# Altium project Design_Project.PrjPCB
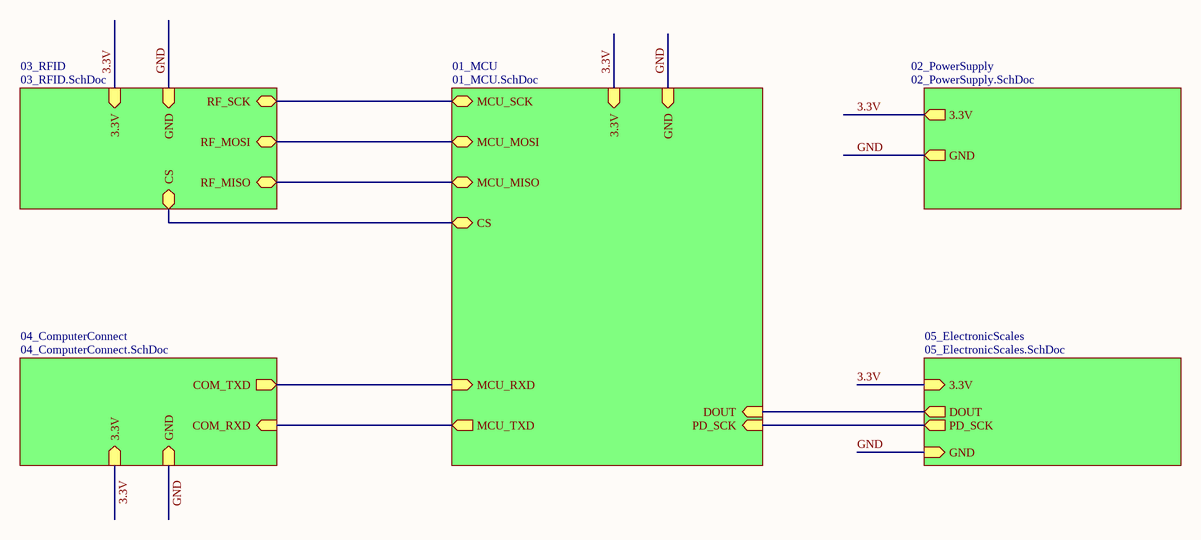
[diagram p0: SheetConnection.SchDoc]
6 sheets, 32 parts. Net scope: hierarchical (ports join the sheet entries above them; power ports are global).
Board files: Design_Project.PcbDoc, Logo.pcbdoc, HX711.PcbDoc
Sheets:
  SheetConnection.SchDoc
    01_MCU = 01_MCU.SchDoc
    05_ElectronicScales = 05_ElectronicScales.SchDoc
    03_RFID = 03_RFID.SchDoc
    04_ComputerConnect = 04_ComputerConnect.SchDoc
    02_PowerSupply = 02_PowerSupply.SchDoc

## Sheet SheetConnection.SchDoc
size A4

### Sub-sheets
01_MCU = 01_MCU.SchDoc: MCU_TXD (out), MCU_RXD (in), MCU_SCK (bidir), MCU_MOSI (bidir), MCU_MISO (bidir), GND (in), 3.3V (in), CS (bidir), DOUT (in), PD_SCK (in)
02_PowerSupply = 02_PowerSupply.SchDoc: 3.3V (out), GND (out)
03_RFID = 03_RFID.SchDoc: RF_SCK (bidir), RF_MOSI (bidir), RF_MISO (bidir), GND (in), 3.3V (in), CS (bidir)
04_ComputerConnect = 04_ComputerConnect.SchDoc: COM_TXD (out), COM_RXD (in), GND (in), 3.3V (in)
05_ElectronicScales = 05_ElectronicScales.SchDoc: 3.3V (in), GND (in), DOUT (out), PD_SCK (out)

### Nets
3.3V: sheet 01_MCU/3.3V, sheet 05_ElectronicScales/3.3V, sheet 03_RFID/3.3V, sheet 04_ComputerConnect/3.3V, sheet 02_PowerSupply/3.3V
GND: sheet 01_MCU/GND, sheet 05_ElectronicScales/GND, sheet 03_RFID/GND, sheet 04_ComputerConnect/GND, sheet 02_PowerSupply/GND
CS: sheet 01_MCU/CS, sheet 03_RFID/CS
DOUT: sheet 01_MCU/DOUT, sheet 05_ElectronicScales/DOUT
MISO: sheet 01_MCU/MCU_MISO, sheet 03_RFID/RF_MISO
MOSI: sheet 01_MCU/MCU_MOSI, sheet 03_RFID/RF_MOSI
PD_SCK: sheet 01_MCU/PD_SCK, sheet 05_ElectronicScales/PD_SCK
SCK: sheet 01_MCU/MCU_SCK, sheet 03_RFID/RF_SCK
NetP1_3: sheet 01_MCU/MCU_RXD, sheet 04_ComputerConnect/COM_TXD
NetP1_4: sheet 01_MCU/MCU_TXD, sheet 04_ComputerConnect/COM_RXD

### Notes on the sheet
- Project:
- MANDevices
- Page Contents:
- Size:
- Date:
- A4
- Checked by:
- Time:
- Revision:
- Sheet
- of
- HaNoi University of
- Science and Technology
- File:

## Sheet 01_MCU.SchDoc
size A4
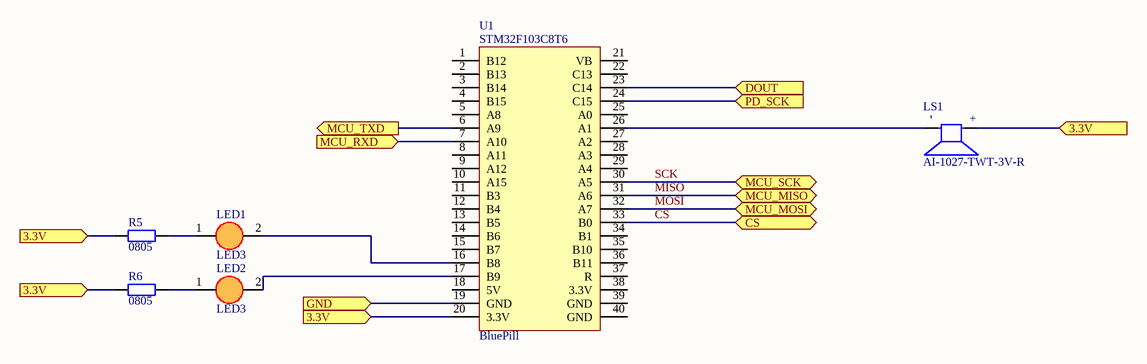
[diagram p1: 01_MCU.SchDoc]

### Parts
LED1  LED3  [LED3mm]
LED2  LED3  [LED3mm]
LS1  AI-1027-TWT-3V-R  [XDCR_AI-1027-TWT-3V-R]
R5  value 0805  [DIEN TRO 0805]  (hidden comment: R0805)
R6  value 0805  [DIEN TRO 0805]  (hidden comment: R0805)
U1  BluePill  [DIP40 - duplicate]

### Ports
3.3V (in), CS (bidir), DOUT (in), GND (in), MCU_MISO (bidir), MCU_MOSI (bidir), MCU_RXD (in), MCU_SCK (bidir), MCU_TXD (out), PD_SCK (in)

### Nets
3.3V: LS1.P R5.1 R6.1 U1.20(3.3V) ; port 3.3V
GND: U1.19(GND) ; port GND
CS: U1.33(B0) ; port CS
DOUT: U1.23(C14) ; port DOUT
MISO: U1.31(A6) ; port MCU_MISO
MOSI: U1.32(A7) ; port MCU_MOSI
PD_SCK: U1.24(C15) ; port PD_SCK
SCK: U1.30(A5) ; port MCU_SCK
NetLED1_1: LED1.1(A) R5.2
NetLED1_2: LED1.2(K) U1.16(B8)
NetLED2_1: LED2.1(A) R6.2
NetLED2_2: LED2.2(K) U1.17(B9)
NetLS1_N: LS1.N U1.26(A1)
NetP1_3: U1.7(A10) ; port MCU_RXD
NetP1_4: U1.6(A9) ; port MCU_TXD

Not connected (* = marked no-connect by the designer): U1 1(B12) 2(B13) 3(B14) 4(B15) 5(A8) 8(A11) 9(A12) 10(A15) 11(B3) 12(B4) 13(B5) 14(B6) 15(B7) 18(5V) 21(VB) 22(C13) 25(A0) 27(A2) 28(A3) 29(A4) 34(B1) 35(B10) 36(B11) 37(R) 38(3.3V) 39(GND) 40(GND)

### Notes on the sheet
- Project:
- MANDevices
- Page Contents:
- Size:
- Date:
- A4
- Checked by:
- Time:
- Revision:
- Sheet
- of
- HaNoi University of
- Science and Technology
- File:
- (in symbol AI-1027-TWT-3V-R) -; +
- (in symbol BluePill) STM32F103C8T6

### Library data of the parts
LED1 LED2 = LED 3mm
LS1 = AI-1027-TWT-3V-R: Buzzers Indicator, Internally Driven Electromechanical/Magnetic 3V 30mA 2.7kHz 80dB @ 3V, 10cm Through Hole PC Pins; MF: PUI Audio, Inc.; Price: None; SnapEDA_Link: https://www.snapeda.com/parts/AI-1027-TWT-3V-R/PUI%20Audio,%20Inc./view-part/7376009/?ref=snap; Purchase-URL: https://pricing.snapeda.com/search/part/AI-1027-TWT-3V-R/?ref=eda; Check_prices: https://www.snapeda.com/parts/AI-1027-TWT-3V-R/PUI%20Audio,%20Inc./view-part/7376009/?ref=eda; Value: *; MP: AI-1027-TWT-3V-R; Package: None; Availability: In Stock
R5 R6 = R0805: Resistor SMD 0805; Published: 8-Jun-2000; LatestRevisionDate: 17-Jul-2002; LatestRevisionNote: Re-released for DXP Platform.; PackageReference: AXIAL-0.4; Publisher: Altium Limited

## Sheet 05_ElectronicScales.SchDoc
size A4
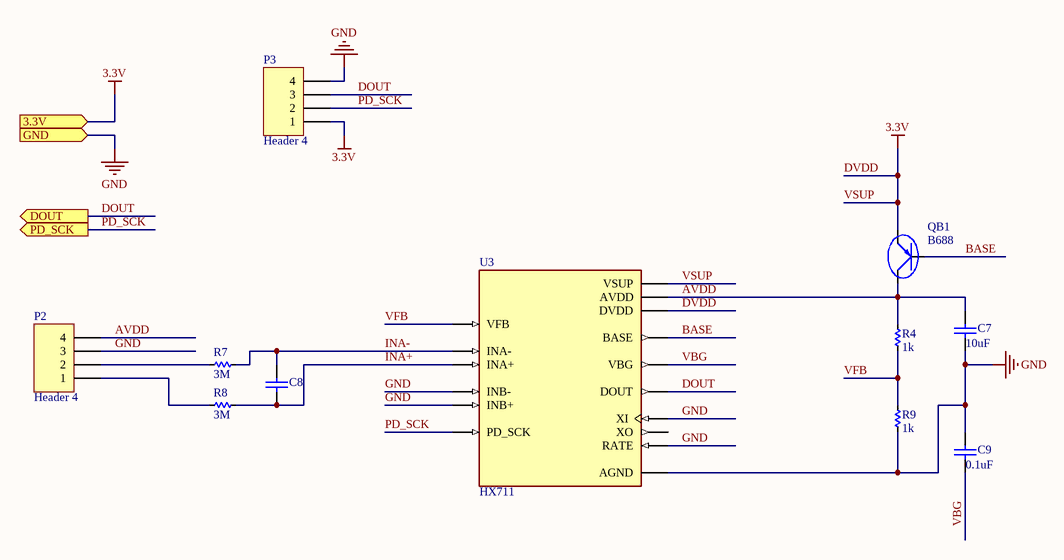
[diagram p2: 05_ElectronicScales.SchDoc]

### Parts
C7  10uF  [C0805]
C8  Capacitor Ceramic  [C0805]  (value not drawn)
C9  0.1uF  [C0805]
P2  Header 4  [HDR1X4]
P3  Header 4  [HDR1X4]
QB1  B688  [QTO-247]
R4  1k  [RES-SMD-0805]
R7  3M  [RES-SMD-0805]
R8  3M  [RES-SMD-0805]
R9  1k  [RES-SMD-0805]
U3  HX711  [SOP127P600X180-16N]

### Ports
3.3V (in), DOUT (out), GND (in), PD_SCK (out)

### Nets
3.3V: P3.1 QB1.3(E) U3.1(VSUP) U3.16(DVDD) ; port 3.3V  [also labelled DVDD, VSUP]
GND: C7.1 C9.2 P2.3 P3.4 R9.2 U3.5(AGND) U3.9(INB-) U3.10(INB+) U3.14(XI) U3.15(RATE) ; port GND
AVDD: C7.2 P2.4 QB1.2(C) R4.1 U3.3(AVDD)
BASE: QB1.1(B) U3.2(BASE)
DOUT: P3.3 U3.12(DOUT) ; port DOUT
INA+: C8.1 R8.2 U3.8(INA+)
INA-: C8.2 R7.2 U3.7(INA-)
PD_SCK: P3.2 U3.11(PD_SCK) ; port PD_SCK
VBG: C9.1 U3.6(VBG)
VFB: R4.2 R9.1 U3.4(VFB)
NetP2_1: P2.1 R8.1
NetP2_2: P2.2 R7.1

Not connected (* = marked no-connect by the designer): U3 13(XO)

### Notes on the sheet
- Project:
- MANDevices
- Page Contents:
- Size:
- Date:
- A4
- Checked by:
- Time:
- Revision:
- Sheet
- of
- HaNoi University of
- Science and Technology
- File:

### Library data of the parts
C7-C9 = CapSMD: Capacitor; Value: 33p; Published: 8-Jun-2000; LatestRevisionDate: 17-Jul-2002; LatestRevisionNote: Re-released for DXP Platform.; PackageReference: RAD-0.3; Publisher: Altium Limited
P2 P3 = Header 4: Header, 4-Pin; LatestRevisionDate: 17-Jul-2002; LatestRevisionNote: Re-released for DXP Platform.; Publisher: Altium Limited
QB1 = B688: Transistor Power Supply; Value: B688
R4 R7-R9 = Res-SMD: Resistor; Manufacturer: Generic Components; Class: Passive; Published: 08/06/2000; Publisher: Altium Hobart Technology Centre
U3 = HX711: Value: *; Availability: Unavailable; Price: None; MP: HX711; Package: None

## Sheet 03_RFID.SchDoc
size A4
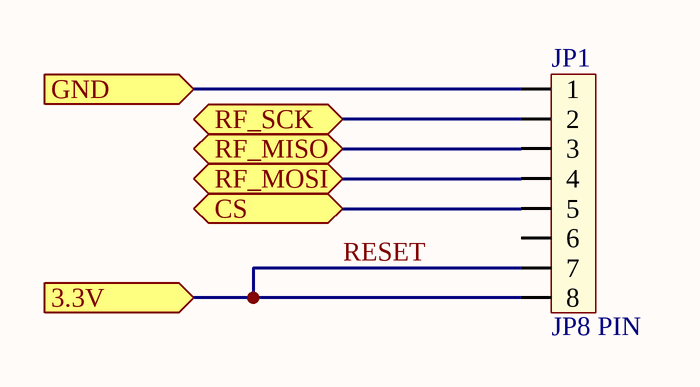
[diagram p3: 03_RFID.SchDoc]

### Parts
JP1  JP8 PIN  [JP8]

### Ports
3.3V (in), CS (bidir), GND (in), RF_MISO (bidir), RF_MOSI (bidir), RF_SCK (bidir)

### Nets
GND: JP1.1 ; port GND
RESET: JP1.7 JP1.8 ; port 3.3V  [project net 3.3V]
CS: JP1.5 ; port CS
MISO: JP1.3 ; port RF_MISO
MOSI: JP1.4 ; port RF_MOSI
SCK: JP1.2 ; port RF_SCK

Not connected (* = marked no-connect by the designer): JP1 6

### Notes on the sheet
- Project:
- MANDevices
- Page Contents:
- Size:
- Date:
- A4
- Checked by:
- Time:
- Revision:
- Sheet
- of
- HaNoi University of
- Science and Technology
- File:

### Library data of the parts
JP1 = JP8: Value: JP7

## Sheet 04_ComputerConnect.SchDoc
size A4
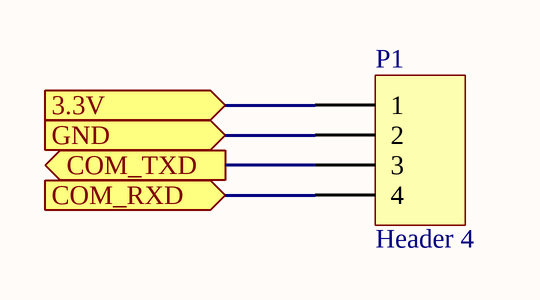
[diagram p4: 04_ComputerConnect.SchDoc]

### Parts
P1  Header 4  [HDR1X4]

### Ports
3.3V (in), COM_RXD (in), COM_TXD (out), GND (in)

### Nets
3.3V: P1.1 ; port 3.3V
GND: P1.2 ; port GND
NetP1_3: P1.3 ; port COM_TXD
NetP1_4: P1.4 ; port COM_RXD

### Notes on the sheet
- Project:
- MANDevices
- Page Contents:
- Size:
- Date:
- A4
- Checked by:
- Time:
- Revision:
- Sheet
- of
- HaNoi University of
- Science and Technology
- File:

### Library data of the parts
P1 = Header 4: Header, 4-Pin; LatestRevisionDate: 17-Jul-2002; LatestRevisionNote: Re-released for DXP Platform.; Publisher: Altium Limited

## Sheet 02_PowerSupply.SchDoc
size A4
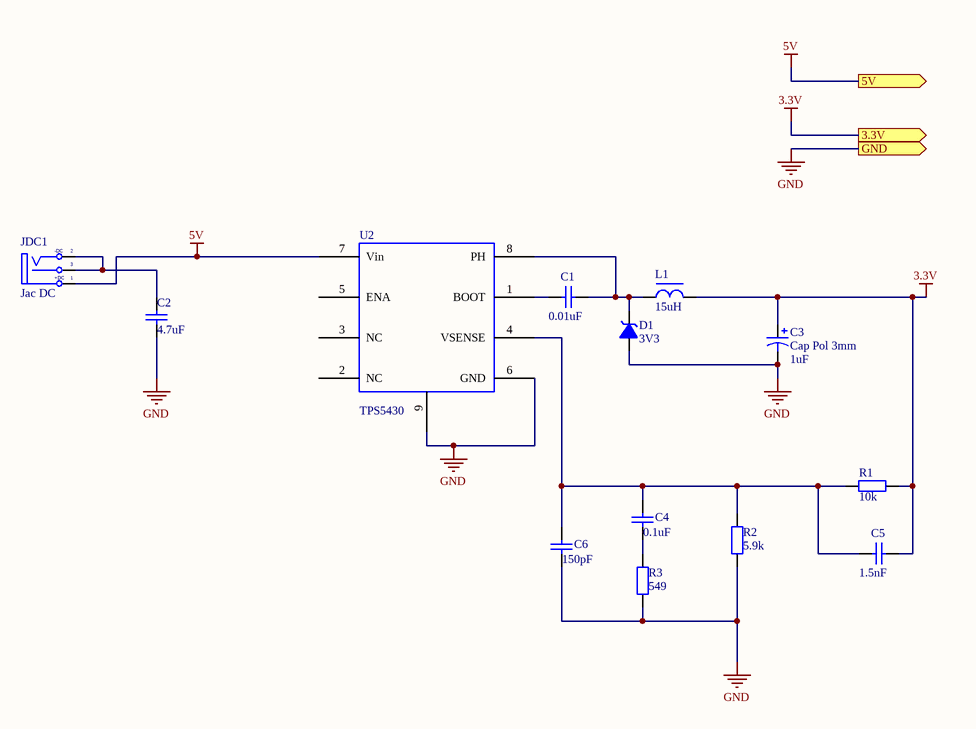
[diagram p5: 02_PowerSupply.SchDoc]

### Parts
C1  0.01uF  [C0805]
C2  4.7uF  [C0805]
C3  Cap Pol 3mm  [C3MM]
C4  0.1uF  [C0805]
C5  1.5nF  [C0805]
C6  150pF  [C0805]
D1  3V3  [DZ0.5A]
JDC1  Jac DC  [DC-IN]
L1  15uH  [L-DIP-M-5.3]
R1  value 10k  [DIEN TRO 0805]  (hidden comment: R0805)
R2  5.9k  [DIEN TRO 0805]
R3  value 549  [DIEN TRO 0805]  (hidden comment: R0805)
U2  TPS5430  [TPS5430-2]

### Ports
3.3V (out), 5V (out), GND (out)

### Nets
3.3V: C3.1 C5.1 L1.2 R1.2 ; port 3.3V
5V: JDC1.1(T) U2.7(Vin) ; port 5V
GND: C2.1 C3.2 C6.1 D1.1(A) R2.1 R3.1 U2.6(GND) U2.9(PWR_PAD) ; port GND
NetC1_1: C1.1 D1.2(K) L1.1 U2.8(PH)
NetC1_2: C1.2 U2.1(BOOT)
NetC2_2: C2.2 JDC1.2(TN) JDC1.3(S)
NetC4_1: C4.1 R3.2
NetC4_2: C4.2 C5.2 C6.2 R1.1 R2.2 U2.4(VSENSE)

Not connected (* = marked no-connect by the designer): U2 2(NC) 3(NC) 5(ENA)

### Notes on the sheet
- Project:
- MANDevices
- Page Contents:
- Size:
- Date:
- A4
- Checked by:
- Time:
- Revision:
- Sheet
- of
- HaNoi University of
- Science and Technology
- File:
- (in symbol Cap Pol 3mm) 1uF
- (in symbol DCIN) -DC; +DC

### Library data of the parts
C1 C2 C4-C6 = CapSMD: Capacitor; Value: 33p; Published: 8-Jun-2000; LatestRevisionDate: 17-Jul-2002; LatestRevisionNote: Re-released for DXP Platform.; PackageReference: RAD-0.3; Publisher: Altium Limited
C3 = Cap Pol 3mm: Polarized Capacitor (Axial); Published: 8-Jun-2000; LatestRevisionDate: 17-Jul-2002; LatestRevisionNote: Re-released for DXP Platform.; PackageReference: POLAR0.8; Publisher: Altium Limited
D1 = DZ: Diode Zenner; Value: 3v3
JDC1 = DCIN: Jac DC input; Value: Jac DC
L1 = L-DIP-1: Inductor; Value: 150 mH
R1-R3 = R0805: Resistor SMD 0805; Published: 8-Jun-2000; LatestRevisionDate: 17-Jul-2002; LatestRevisionNote: Re-released for DXP Platform.; PackageReference: AXIAL-0.4; Publisher: Altium Limited
  R2: Value: 5.9k
U2 = TPS5430: Name: TPS5430

## Nets that join several sheets
3.3V: 01_MCU (LS1.P R5.1 R6.1 U1.20), 05_ElectronicScales (P3.1 QB1.3 U3.1 U3.16), 03_RFID (JP1.7 JP1.8), 04_ComputerConnect (P1.1), 02_PowerSupply (C3.1 C5.1 L1.2 R1.2)
GND: 01_MCU (U1.19), 05_ElectronicScales (10 pins), 03_RFID (JP1.1), 04_ComputerConnect (P1.2), 02_PowerSupply (8 pins)
CS: 01_MCU (U1.33), 03_RFID (JP1.5)
DOUT: 01_MCU (U1.23), 05_ElectronicScales (P3.3 U3.12)
MISO: 01_MCU (U1.31), 03_RFID (JP1.3)
MOSI: 01_MCU (U1.32), 03_RFID (JP1.4)
NetP1_3: 01_MCU (U1.7), 04_ComputerConnect (P1.3)
NetP1_4: 01_MCU (U1.6), 04_ComputerConnect (P1.4)
PD_SCK: 01_MCU (U1.24), 05_ElectronicScales (P3.2 U3.11)
SCK: 01_MCU (U1.30), 03_RFID (JP1.2)